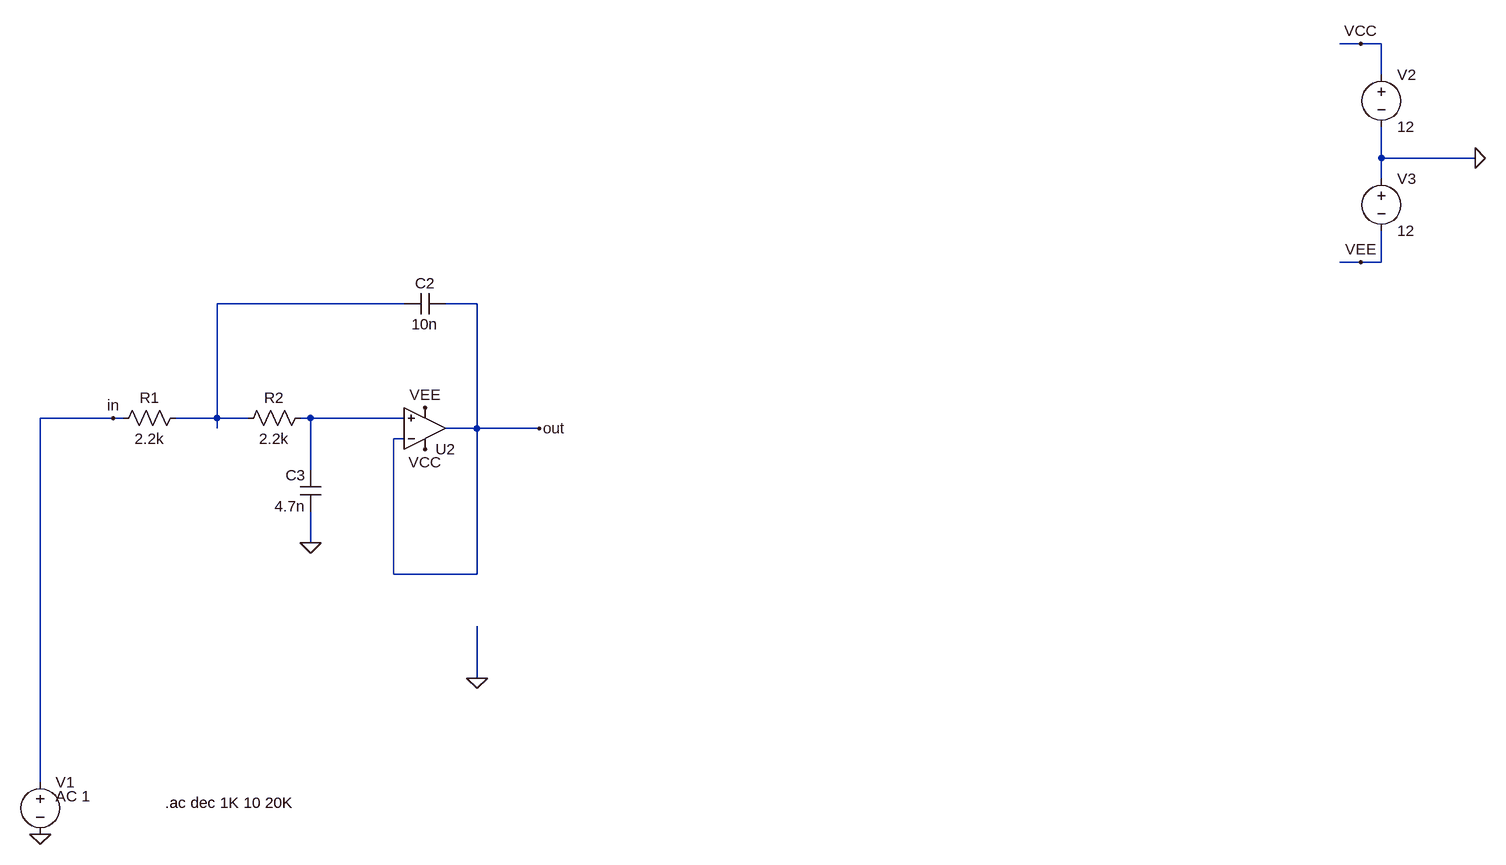
[diagram p0: schematic Sallen-Key.asc]
Sallen-Key.asc, the LTspice schematic file:
Version 4
SHEET 1 2208 864
WIRE 2016 -368 1984 -368
WIRE 2048 -368 2016 -368
WIRE 2048 -320 2048 -368
WIRE 2048 -192 2048 -240
WIRE 2192 -192 2048 -192
WIRE 2048 -160 2048 -192
WIRE 2016 -32 1984 -32
WIRE 2048 -32 2048 -80
WIRE 2048 -32 2016 -32
WIRE 544 32 256 32
WIRE 656 32 608 32
WIRE 96 208 -16 208
WIRE 112 208 96 208
WIRE 256 208 256 32
WIRE 256 208 192 208
WIRE 304 208 256 208
WIRE 400 208 384 208
WIRE 544 208 400 208
WIRE 256 224 256 208
WIRE 656 224 656 32
WIRE 656 224 608 224
WIRE 752 224 656 224
WIRE 544 240 528 240
WIRE 400 288 400 208
WIRE 400 400 400 352
WIRE 528 448 528 240
WIRE 656 448 656 224
WIRE 656 448 528 448
WIRE 656 608 656 528
WIRE -16 768 -16 208
FLAG 576 256 VCC
FLAG 576 192 VEE
FLAG 656 608 0
FLAG 96 208 in
FLAG 752 224 out
FLAG -16 848 0
FLAG 2016 -32 VEE
FLAG 2192 -192 0
FLAG 2016 -368 VCC
FLAG 400 400 0
SYMBOL res 208 192 R90
WINDOW 0 0 56 VBottom 2
WINDOW 3 32 56 VTop 2
SYMATTR InstName R1
SYMATTR Value 2.2k
SYMBOL res 400 192 R90
WINDOW 0 0 56 VBottom 2
WINDOW 3 32 56 VTop 2
SYMATTR InstName R2
SYMATTR Value 2.2k
SYMBOL cap 544 48 R270
WINDOW 0 32 32 VTop 2
WINDOW 3 0 32 VBottom 2
SYMATTR InstName C2
SYMATTR Value 10n
SYMBOL OpAmps/UniversalOpAmp2 576 224 M180
SYMATTR InstName U2
SYMBOL cap 416 352 R180
WINDOW 0 24 56 Left 2
WINDOW 3 24 8 Left 2
SYMATTR InstName C3
SYMATTR Value 4.7n
SYMBOL voltage -16 752 R0
WINDOW 123 24 38 Left 2
SYMATTR InstName V1
SYMATTR Value ""
SYMATTR Value2 AC 1
SYMBOL voltage 2048 -336 R0
SYMATTR InstName V2
SYMATTR Value 12
SYMBOL voltage 2048 -176 R0
SYMATTR InstName V3
SYMATTR Value 12
TEXT 176 800 Left 2 !.ac dec 1K 10 20K

The netlist it stands for:
* Sallen-Key.asc
R1 N001 in 2.2k
R2 N002 N001 2.2k
C2 N001 out 10n
XU2 N002 out VCC VEE out level2 Avol=1Meg GBW=10Meg Slew=10Meg Ilimit=25m Rail=0 Vos=0 En=0 Enk=0 In=0 Ink=0 Rin=500Meg  ; pins In+ In- V+ V- OUT
C3 0 N002 4.7n
V1 in 0 AC 1
V2 VCC 0 12
V3 0 VEE 12
.ac dec 1K 10 20K
.lib UniversalOpAmp2.lib
.backanno
.end